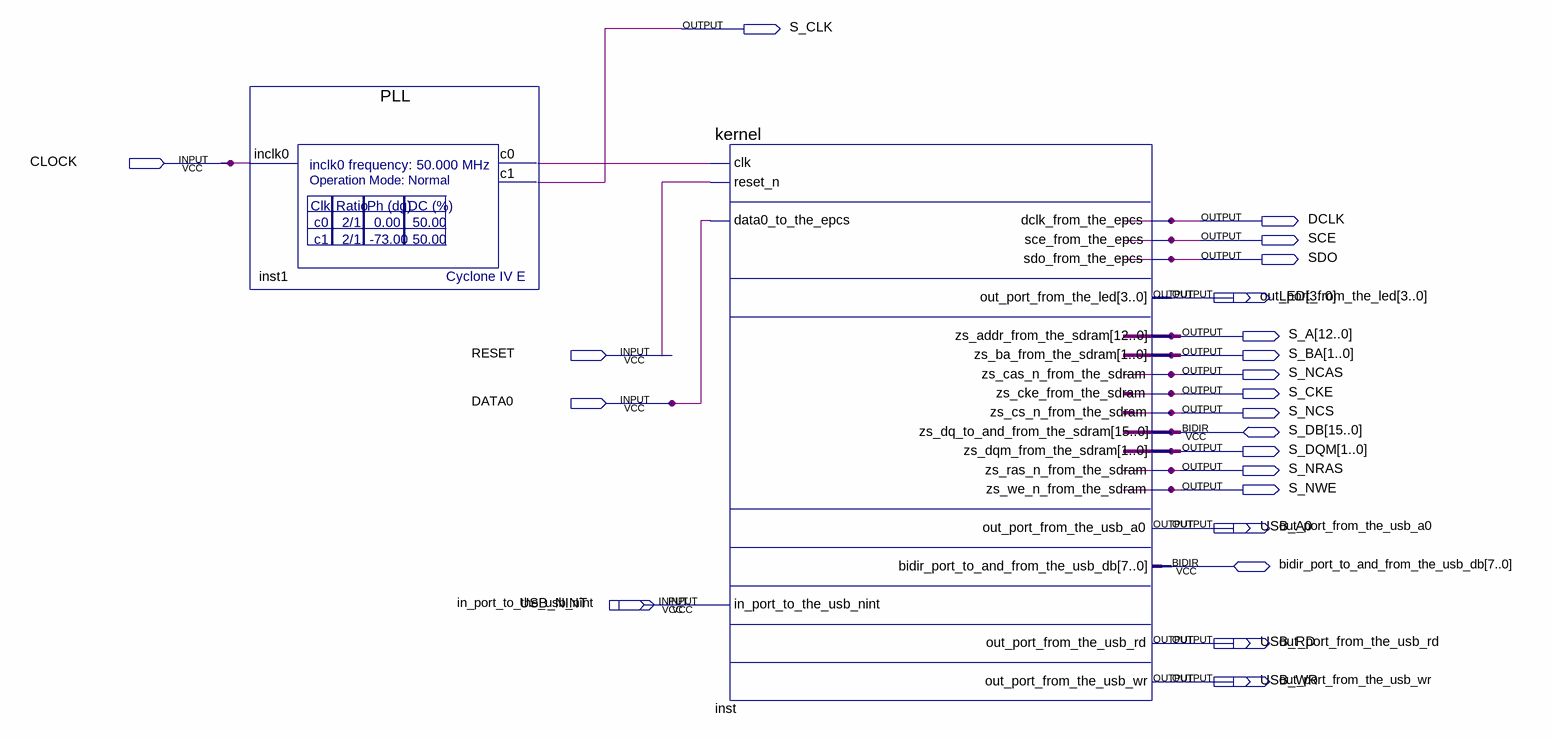
[diagram p0: schematic sheet]
// Quartus schematic HELLO.bdf as structural Verilog: 2 symbols, 27 pins
module HELLO (
  input  CLOCK,
  input  RESET,
  input  DATA0,
  input  in_port_to_the_usb_nint,
  input  USB_NINT,
  inout  [15:0] S_DB,
  inout  [7:0] bidir_port_to_and_from_the_usb_db,
  output S_CLK,
  output DCLK,
  output SCE,
  output SDO,
  output [3:0] out_port_from_the_led,
  output [3:0] LED,
  output [12:0] S_A,
  output [1:0] S_BA,
  output S_NCAS,
  output S_CKE,
  output S_NCS,
  output [1:0] S_DQM,
  output S_NRAS,
  output S_NWE,
  output USB_A0,
  output out_port_from_the_usb_a0,
  output USB_RD,
  output out_port_from_the_usb_rd,
  output USB_WR,
  output out_port_from_the_usb_wr
);

  wire inst1_c0, undriven;

  PLL inst1 (.inclk0(CLOCK), .c0(inst1_c0), .c1(S_CLK));
  kernel inst (
    .clk(inst1_c0), .reset_n(undriven), .data0_to_the_epcs(DATA0),
    .in_port_to_the_usb_nint(in_port_to_the_usb_nint), .dclk_from_the_epcs(DCLK), .sce_from_the_epcs(SCE),
    .sdo_from_the_epcs(SDO), .out_port_from_the_led(LED), .zs_addr_from_the_sdram(S_A),
    .zs_ba_from_the_sdram(S_BA), .zs_cas_n_from_the_sdram(S_NCAS), .zs_cke_from_the_sdram(S_CKE),
    .zs_cs_n_from_the_sdram(S_NCS), .zs_dqm_from_the_sdram(S_DQM), .zs_ras_n_from_the_sdram(S_NRAS),
    .zs_we_n_from_the_sdram(S_NWE), .out_port_from_the_usb_a0(out_port_from_the_usb_a0),
    .out_port_from_the_usb_rd(out_port_from_the_usb_rd), .out_port_from_the_usb_wr(out_port_from_the_usb_wr),
    .zs_dq_to_and_from_the_sdram(S_DB), .bidir_port_to_and_from_the_usb_db(bidir_port_to_and_from_the_usb_db));
endmodule
